# Altium schematic sheet 07_H3HDMI.SchDoc
size A3
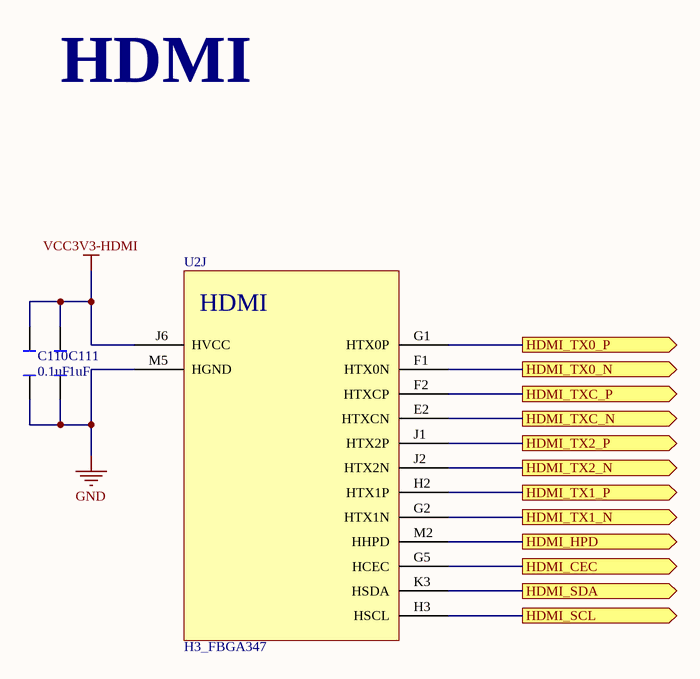
[diagram p0: 07_H3HDMI.SchDoc]

## Parts
C110  0.1uF  [C0402]
C111  1uF  [C0402]
U2  H3_FBGA347  [H3_FBGA327]  (part J of 16)

## Ports
HDMI_CEC (out), HDMI_HPD (out), HDMI_SCL (out), HDMI_SDA (out), HDMI_TX0_N (out), HDMI_TX0_P (out), HDMI_TX1_N (out), HDMI_TX1_P (out), HDMI_TX2_N (out), HDMI_TX2_P (out), HDMI_TXC_N (out), HDMI_TXC_P (out)

## Nets
GND: C110.1 C111.1 U2.M5(HGND)
VCC3V3-HDMI: C110.2 C111.2 U2.J6(HVCC)
HDMI_CEC: U2.G5(HCEC) ; port HDMI_CEC
HDMI_HPD: U2.M2(HHPD) ; port HDMI_HPD
HDMI_SCL: U2.H3(HSCL) ; port HDMI_SCL
HDMI_SDA: U2.K3(HSDA) ; port HDMI_SDA
HDMI_TX0_N: U2.F1(HTX0N) ; port HDMI_TX0_N
HDMI_TX0_P: U2.G1(HTX0P) ; port HDMI_TX0_P
HDMI_TX1_N: U2.G2(HTX1N) ; port HDMI_TX1_N
HDMI_TX1_P: U2.H2(HTX1P) ; port HDMI_TX1_P
HDMI_TX2_N: U2.J2(HTX2N) ; port HDMI_TX2_N
HDMI_TX2_P: U2.J1(HTX2P) ; port HDMI_TX2_P
HDMI_TXC_N: U2.E2(HTXCN) ; port HDMI_TXC_N
HDMI_TXC_P: U2.F2(HTXCP) ; port HDMI_TXC_P

## Notes on the sheet
- HDMI
- (in symbol H3_FBGA347, part J) HDMI

## Library data of the parts
C110 = C_0.1UF
C111 = C_1UF